# Altium schematic sheet Sheet1.SchDoc
size A3
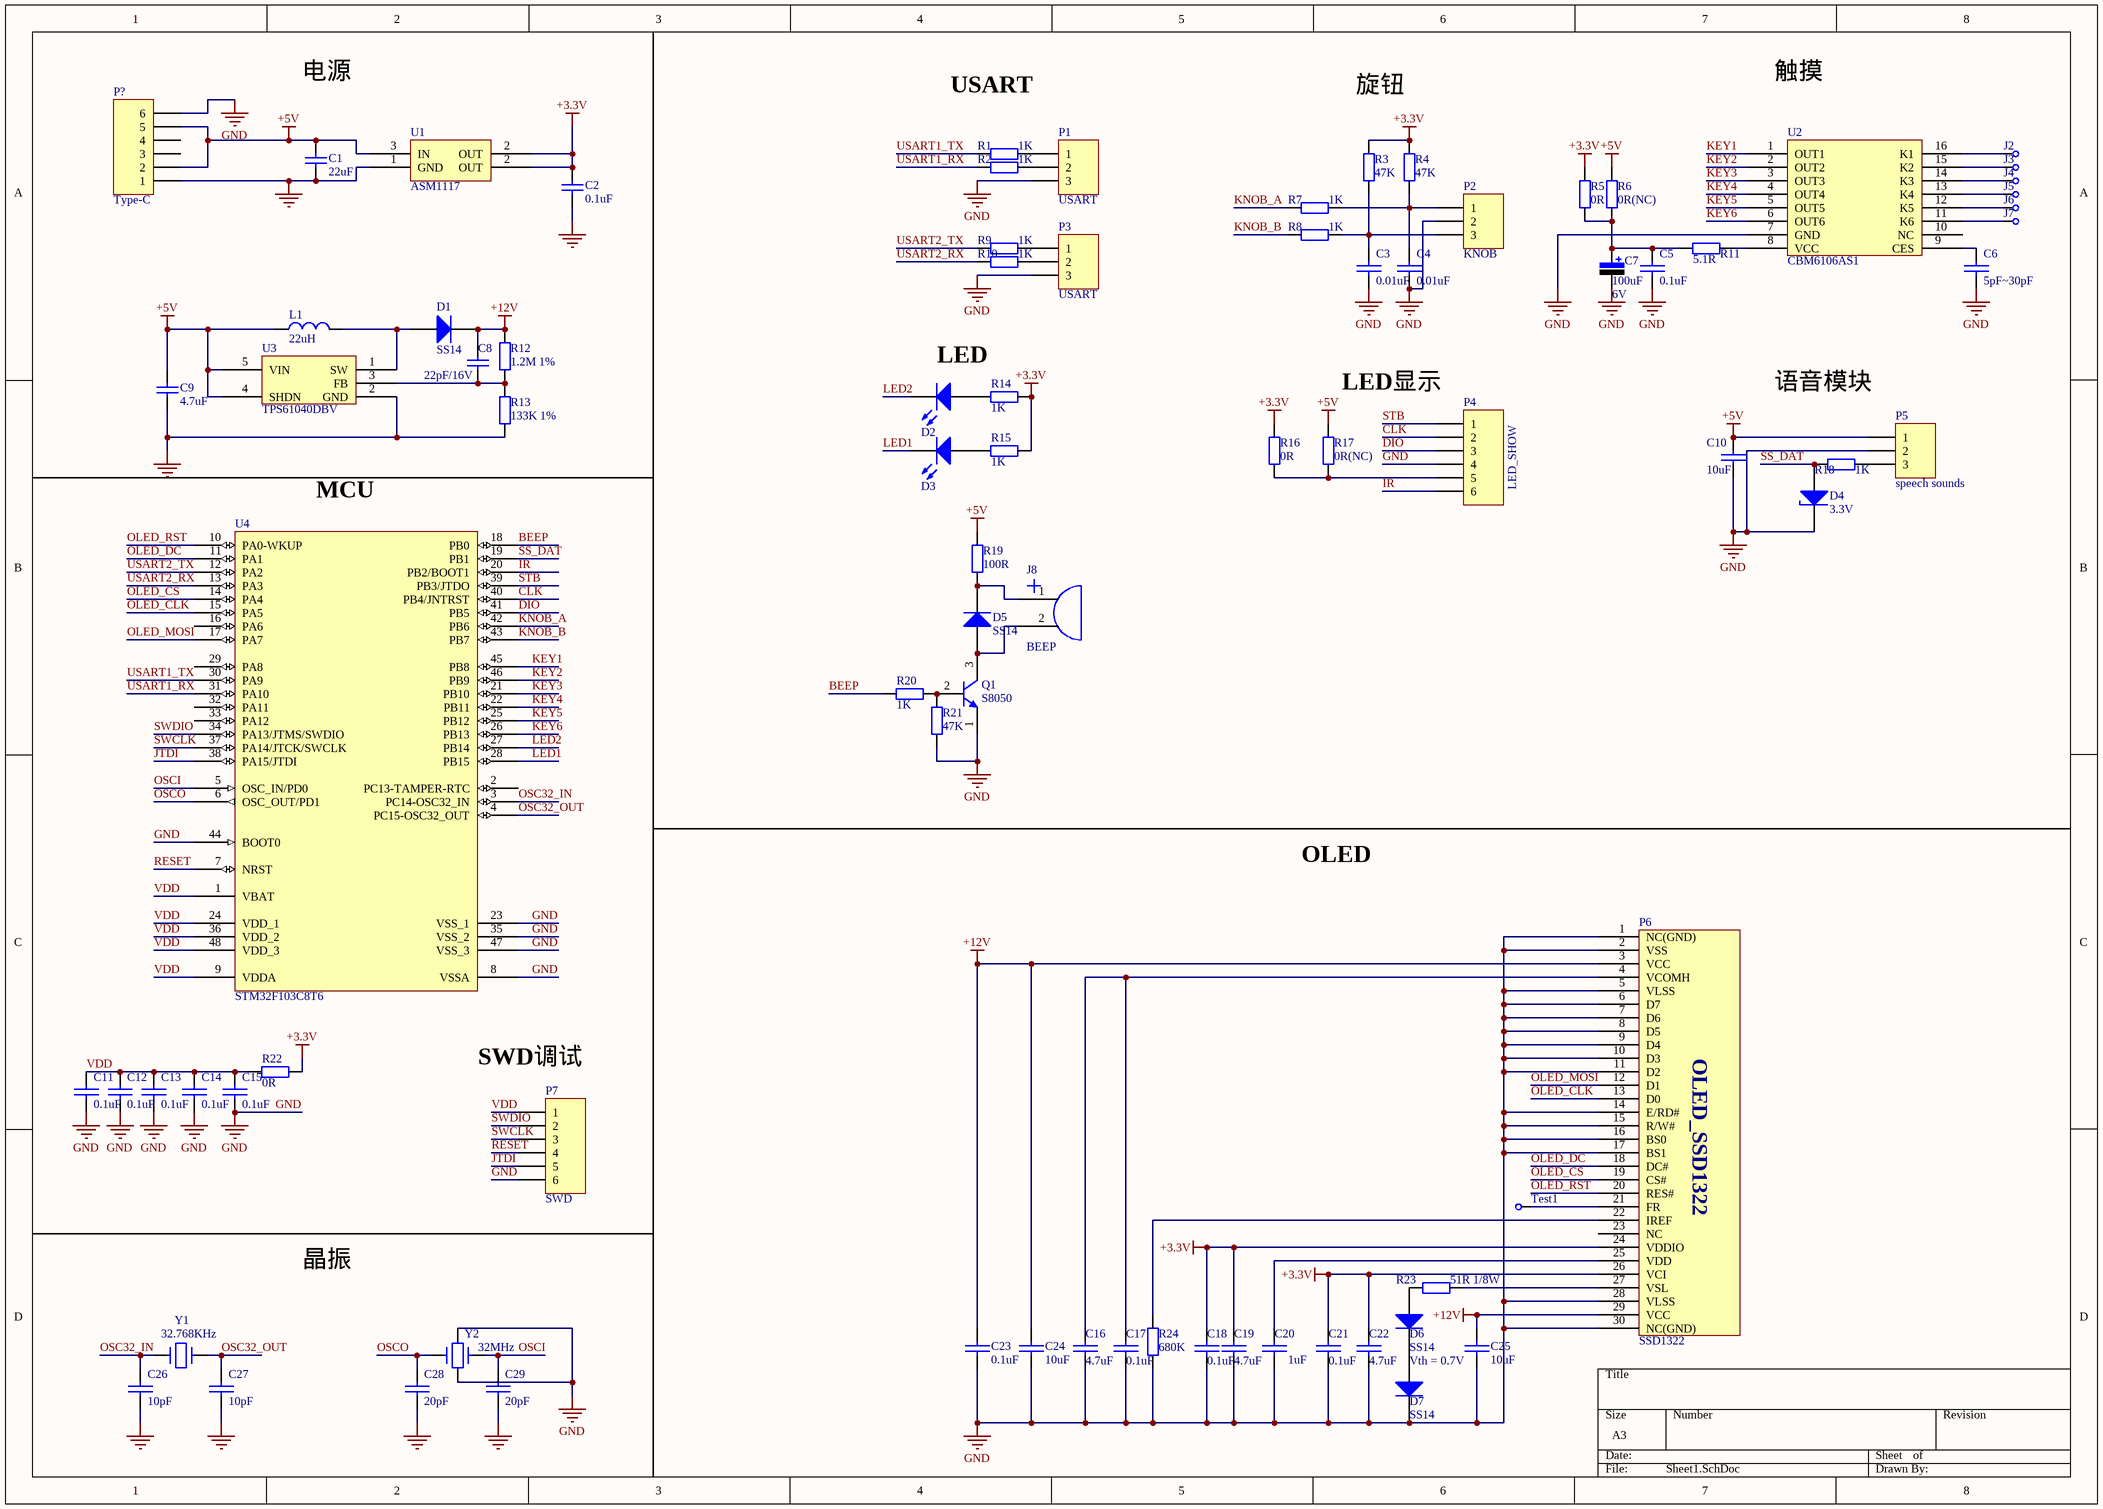
[diagram p0: Sheet1.SchDoc]

## Parts
C1  value 22uF  [0402C]  (hidden comment: Cap)
C2  value 0.1uF  [0402C]  (hidden comment: Cap)
C3  0.01uF  [0402C]
C4  0.01uF  [0402C]
C5  0.1uF  [0402C]
C6  5pF~30pF  [0402C]
C7  value 100uF  Vol: 6V  [CAP-3528]  (hidden comment: Cap Pol)
C8  value 22pF/16V  [0402C]  (hidden comment: Cap)
C9  value 4.7uF  [0402C]  (hidden comment: Cap)
C10  10uF  [0402C]
C11  0.1uF  [0402C]
C12  0.1uF  [0402C]
C13  0.1uF  [0402C]
C14  0.1uF  [0402C]
C15  0.1uF  [0402C]
C16  4.7uF  [0402C]
C17  0.1uF  [0402C]
C18  0.1uF  [0402C]
C19  4.7uF  [0402C]
C20  1uF  [0402C]
C21  0.1uF  [0402C]
C22  4.7uF  [0402C]
C23  0.1uF  [0402C]
C24  10uF  [0402C]
C25  10uF  [0402C]
C26  10pF  [0402C]
C27  10pF  [0402C]
C28  20pF  [0402C]
C29  20pF  [0402C]
D1  Type: SS14  [DIODE-1206]  (hidden comment: Diode)
D2  LED0  [led0603]  (value not drawn)
D3  LED0  [led0603]  (value not drawn)
D4  value 3.3V  [DIODE-1206]  (hidden comment: Diode-Z)
D5  Type: SS14  [DIODE-1206]  (hidden comment: Diode)
D6  Type: SS14  [DIODE-1206]  (hidden comment: Diode)
D7  Type: SS14  [DIODE-1206]  (hidden comment: Diode)
J2  CHECK  [CHECK-A]  (value not drawn)
J3  CHECK  [CHECK-A]  (value not drawn)
J4  CHECK  [CHECK-A]  (value not drawn)
J5  CHECK  [CHECK-A]  (value not drawn)
J6  CHECK  [CHECK-A]  (value not drawn)
J7  CHECK  [CHECK-A]  (value not drawn)
J8  BEEP  [Beep]
L1  value 22uH  [1206]  (hidden comment: Inductor)
P1  USART  [HDR3X1_A]
P2  KNOB  [HDR3X1_A]
P3  USART  [HDR3X1_A]
P4  LED_SHOW  [HDR6X1_B2]
P5  speech sounds  [HDR3X1_A]
P6  SSD1322
P7  SWD  [HDR6X1_B2]
P?  Type-C  [HDR6X1_B2]
Q1  S8050  [TO-92A]
R1  value 1K  [0402R]  (hidden comment: Res1)
R2  value 1K  [0402R]  (hidden comment: Res1)
R3  value 47K  [0603-1]  (hidden comment: Res1)
R4  value 47K  [0603-1]  (hidden comment: Res1)
R5  value 0R  [0402R]  (hidden comment: Res1)
R6  value 0R(NC)  [0402R]  (hidden comment: Res1)
R7  value 1K  [0603-1]  (hidden comment: Res1)
R8  value 1K  [0603-1]  (hidden comment: Res1)
R9  value 1K  [0402R]  (hidden comment: Res1)
R10  value 1K  [0402R]  (hidden comment: Res1)
R11  value 5.1R  [0603-1]  (hidden comment: Res1)
R12  value 1.2M 1%  [0402R]  (hidden comment: Res1)
R13  value 133K 1%  [0402R]  (hidden comment: Res1)
R14  value 1K  [0402R]  (hidden comment: Res1)
R15  value 1K  [0402R]  (hidden comment: Res1)
R16  value 0R  [0402R]  (hidden comment: Res1)
R17  value 0R(NC)  [0402R]  (hidden comment: Res1)
R18  value 1K  [0402R]  (hidden comment: Res1)
R19  value 100R  [0402R]  (hidden comment: Res1)
R20  value 1K  [0402R]  (hidden comment: Res1)
R21  value 47K  [0402R]  (hidden comment: Res1)
R22  value 0R  [0402R]  (hidden comment: Res1)
R23  value 51R 1/8W  [0402R]  (hidden comment: Res1)
R24  value 680K  [0402R]  (hidden comment: Res1)
Test1  CHECK  [CHECK-A]  (value not drawn)
U1  ASM1117  [SOT-223]
U2  CBM6106AS1
U3  TPS61040DBV
U4  STM32F103C8T6  [LQFP48_N]
Y1  32.768KHz  [SMD3215]
Y2  32MHz  [Y3225]

## Nets
+3.3V: C2.2 C18.1 C19.1 C21.1 C22.1 P6.24(VDDIO) P6.26(VCI) R3.2 R4.2 R5.1 R14.1 R15.1 R16.1 R22.2 U1.2(OUT)
+5V: C1.2 C9.2 C10.1 L1.1 P5.1 P?.2 P?.5 R6.1 R17.1 R19.1 U1.3(IN) U3.4(SHDN) U3.5(VIN)
+12V: C8.2 C23.2 C24.2 C25.2 D1.2(K) P6.3(VCC) P6.29(VCC) R12.1
GND: C1.1 C2.1 C3.2 C4.2 C5.2 C6.2 C7.2 C9.1 C10.2 C11.2 C12.2 C13.2 C14.2 C15.2 C16.2 C17.2 C18.2 C19.2 C20.2 C21.2 C22.2 C23.1 C24.1 C25.1 C26.2 C27.2 C28.2 C29.2 D4.2(K) D7.2(K) P1.3 P2.2 P3.3 P4.4 P5.2 P6.1(NC(GND)) P6.2(VSS) P6.5(VLSS) P6.6(D7) P6.7(D6) P6.8(D5) P6.9(D4) P6.10(D3) P6.11(D2) P6.14(E/RD#) P6.15(R/W#) P6.16(BS0) P6.17(BS1) P6.28(VLSS) P6.30(NC(GND)) P7.6 P?.1 P?.6 Q1.1(E) R13.2 R21.1 R24.2 U1.1(GND) U2.7(GND) U3.2(GND) U4.8(VSSA) U4.23(VSS_1) U4.35(VSS_2) U4.44(BOOT0) U4.47(VSS_3) Y2.2 Y2.4
BEEP: R20.1 U4.18(PB0)
CLK: P4.2 U4.40(PB4/JNTRST)
DIO: P4.3 U4.41(PB5)
IR: P4.6 U4.20(PB2/BOOT1)
JTDI: P7.5 U4.38(PA15/JTDI)
KEY1: U2.1(OUT1) U4.45(PB8)
KEY2: U2.2(OUT2) U4.46(PB9)
KEY3: U2.3(OUT3) U4.21(PB10)
KEY4: U2.4(OUT4) U4.22(PB11)
KEY5: U2.5(OUT5) U4.25(PB12)
KEY6: U2.6(OUT6) U4.26(PB13)
KNOB_A: R7.1 U4.42(PB6)
KNOB_B: R8.1 U4.43(PB7)
LED1: D3.2(K) U4.28(PB15)
LED2: D2.2(K) U4.27(PB14)
OLED_CLK: P6.13(D0) U4.15(PA5)
OLED_CS: P6.19(CS#) U4.14(PA4)
OLED_DC: P6.18(DC#) U4.11(PA1)
OLED_MOSI: P6.12(D1) U4.17(PA7)
OLED_RST: P6.20(RES#) U4.10(PA0-WKUP)
OSC32_IN: C26.1 U4.3(PC14-OSC32_IN) Y1.1
OSC32_OUT: C27.1 U4.4(PC15-OSC32_OUT) Y1.2
OSCI: C29.1 U4.5(OSC_IN/PD0) Y2.3
OSCO: C28.1 U4.6(OSC_OUT/PD1) Y2.1
RESET: P7.4 U4.7(NRST)
SS_DAT: D4.1(A) R18.2 U4.19(PB1)
STB: P4.1 U4.39(PB3/JTDO)
SWCLK: P7.3 U4.37(PA14/JTCK/SWCLK)
SWDIO: P7.2 U4.34(PA13/JTMS/SWDIO)
USART1_RX: R2.2 U4.31(PA10)
USART1_TX: R1.2 U4.30(PA9)
USART2_RX: R10.2 U4.13(PA3)
USART2_TX: R9.2 U4.12(PA2)
VDD: C11.1 C12.1 C13.1 C14.1 C15.1 P7.1 R22.1 U4.1(VBAT) U4.9(VDDA) U4.24(VDD_1) U4.36(VDD_2) U4.48(VDD_3)
NetC3_1: C3.1 P2.3 R3.1 R8.2
NetC4_1: C4.1 P2.1 R4.1 R7.2
NetC5_1: C5.1 C7.1 R5.2 R6.2 R11.1
NetC6_1: C6.1 U2.9(CES)
NetC8_1: C8.1 R12.2 R13.1 U3.3(FB)
NetC16_1: C16.1 C17.1 P6.4(VCOMH)
NetC20_1: C20.1 P6.25(VDD)
NetD1_1: D1.1(A) L1.2 U3.1(SW)
NetD2_1: D2.1(A) R14.2
NetD3_1: D3.1(A) R15.2
NetD5_1: D5.1(A) J8.2 Q1.3(C)
NetD5_2: D5.2(K) J8.1 R19.2
NetD6_1: D6.1(A) R23.2
NetD6_2: D6.2(K) D7.1(A)
NetJ2_1: J2.1 U2.16(K1)
NetJ3_1: J3.1 U2.15(K2)
NetJ4_1: J4.1 U2.14(K3)
NetJ5_1: J5.1 U2.13(K4)
NetJ6_1: J6.1 U2.12(K5)
NetJ7_1: J7.1 U2.11(K6)
NetP1_1: P1.1 R1.1
NetP1_2: P1.2 R2.1
NetP3_1: P3.1 R9.1
NetP3_2: P3.2 R10.1
NetP4_5: P4.5 R16.2 R17.2
NetP5_3: P5.3 R18.1
NetP6_21: P6.21(FR) Test1.1
NetP6_22: P6.22(IREF) R24.1
NetP6_27: P6.27(VSL) R23.1
NetQ1_2: Q1.2(B) R20.2 R21.2
NetR11_2: R11.2 U2.8(VCC)

Not connected (* = marked no-connect by the designer): P6 23(NC); P? 3 4; U2 10(NC); U4 2(PC13-TAMPER-RTC) 16(PA6) 29(PA8) 32(PA11) 33(PA12)

## Notes on the sheet
- 电源
- USART
- 旋钮
- 触摸
- LED
- LED显示
- 语音模块
- (near U4) MCU
- OLED
- (near P7) SWD调试
- 晶振
- Vth = 0.7V
- (in symbol SSD1322) OLED_SSD1322

## Library data of the parts
C1 C2 C8 C9 = Cap: 无极性电容; Published: 8-Jun-2000; LatestRevisionDate: 17-Jul-2002; LatestRevisionNote: Re-released for DXP Platform.; PackageReference: RAD-0.3; Publisher: Altium Limited
C3-C6 C10-C29 = CAP: Capacitor
C7 = Cap Pol: 极性电解电容; Published: 8-Jun-2000; LatestRevisionDate: 17-Jul-2002; LatestRevisionNote: Re-released for DXP Platform.; PackageReference: RB7.6-15; Publisher: Altium Limited
D1 D5-D7 = Diode: 二极管; Published: 8-Jun-2000; LatestRevisionDate: 17-Jul-2002; LatestRevisionNote: Re-released for DXP Platform.; PackageDocument: Sep-1996; PackageReference: SMC; Publisher: Altium Limited; Code_JEDEC: DO-214-AB
D2 D3 = LED0: 发光二极管; Published: 8-Jun-2000; LatestRevisionDate: 08-Jul-2005; LatestRevisionNote: Mech Layer 1 removed.; PackageReference: LED-0; Publisher: Altium Limited
D4 = Diode-Z: 稳压二极管; Published: 8-Jun-2000; LatestRevisionDate: 17-Jul-2002; LatestRevisionNote: Re-released for DXP Platform.; PackageReference: SMB; Publisher: Altium Limited; Code_JEDEC: DO-214-AA
J2-J7 Test1 = CHECK: 测试点
J8 = BEEP: 蜂鸣器
L1 = Inductor: 电感; Code_IEC: 1005; Published: 8-Jun-2000; LatestRevisionDate: 17-Jul-2002; LatestRevisionNote: Re-released for DXP Platform.; PackageReference: 0402-A; Publisher: Altium Limited; Code_JEITA: 0402
P1-P3 P5 = Header 3: 接插件; LatestRevisionDate: 17-Jul-2002; LatestRevisionNote: Re-released for DXP Platform.; Publisher: Altium Limited
P4 P7 P? = Header 6: 接插件; LatestRevisionDate: 17-Jul-2002; LatestRevisionNote: Re-released for DXP Platform.; Publisher: Altium Limited
Q1 = S8050: NPN三极管; Published: 8-Jun-2000; LatestRevisionDate: 15-Jan-2003; LatestRevisionNote: PCB Footprint 'BCY-W3/D4.7' replaced; DatasheetDocument: 1997; PackageDocument: Sep-1998; PackageReference: TO-92A; Publisher: Altium Limited; Code_JEDEC: TO-92A; ComponentLink1Description: Manufacturer Link; ComponentLink1URL: http://www.fairchildsemi.com/; ComponentLink2Description: Datasheet; ComponentLink2URL: http://www.fairchildsemi.com/ds/2N%2F2N3904.pdf
R1-R24 = Res1: 贴片电阻; Published: 8-Jun-2000; LatestRevisionDate: 17-Jul-2002; LatestRevisionNote: Re-released for DXP Platform.; PackageReference: AXIAL-0.4; Publisher: Altium Limited
U1 = ASM1117: 3.3V稳压芯片
U4 = STM32F103C8T6: STM32 ARM-based 32-bit MCU with 64 Kbytes Flash, 48-pin LQFP, Industrial Temperature
Y1 = CRYSTAL
Y2 = CRYSTAL1